# EAGLE design HVIB_v2 (EAGLE 9.1.3)
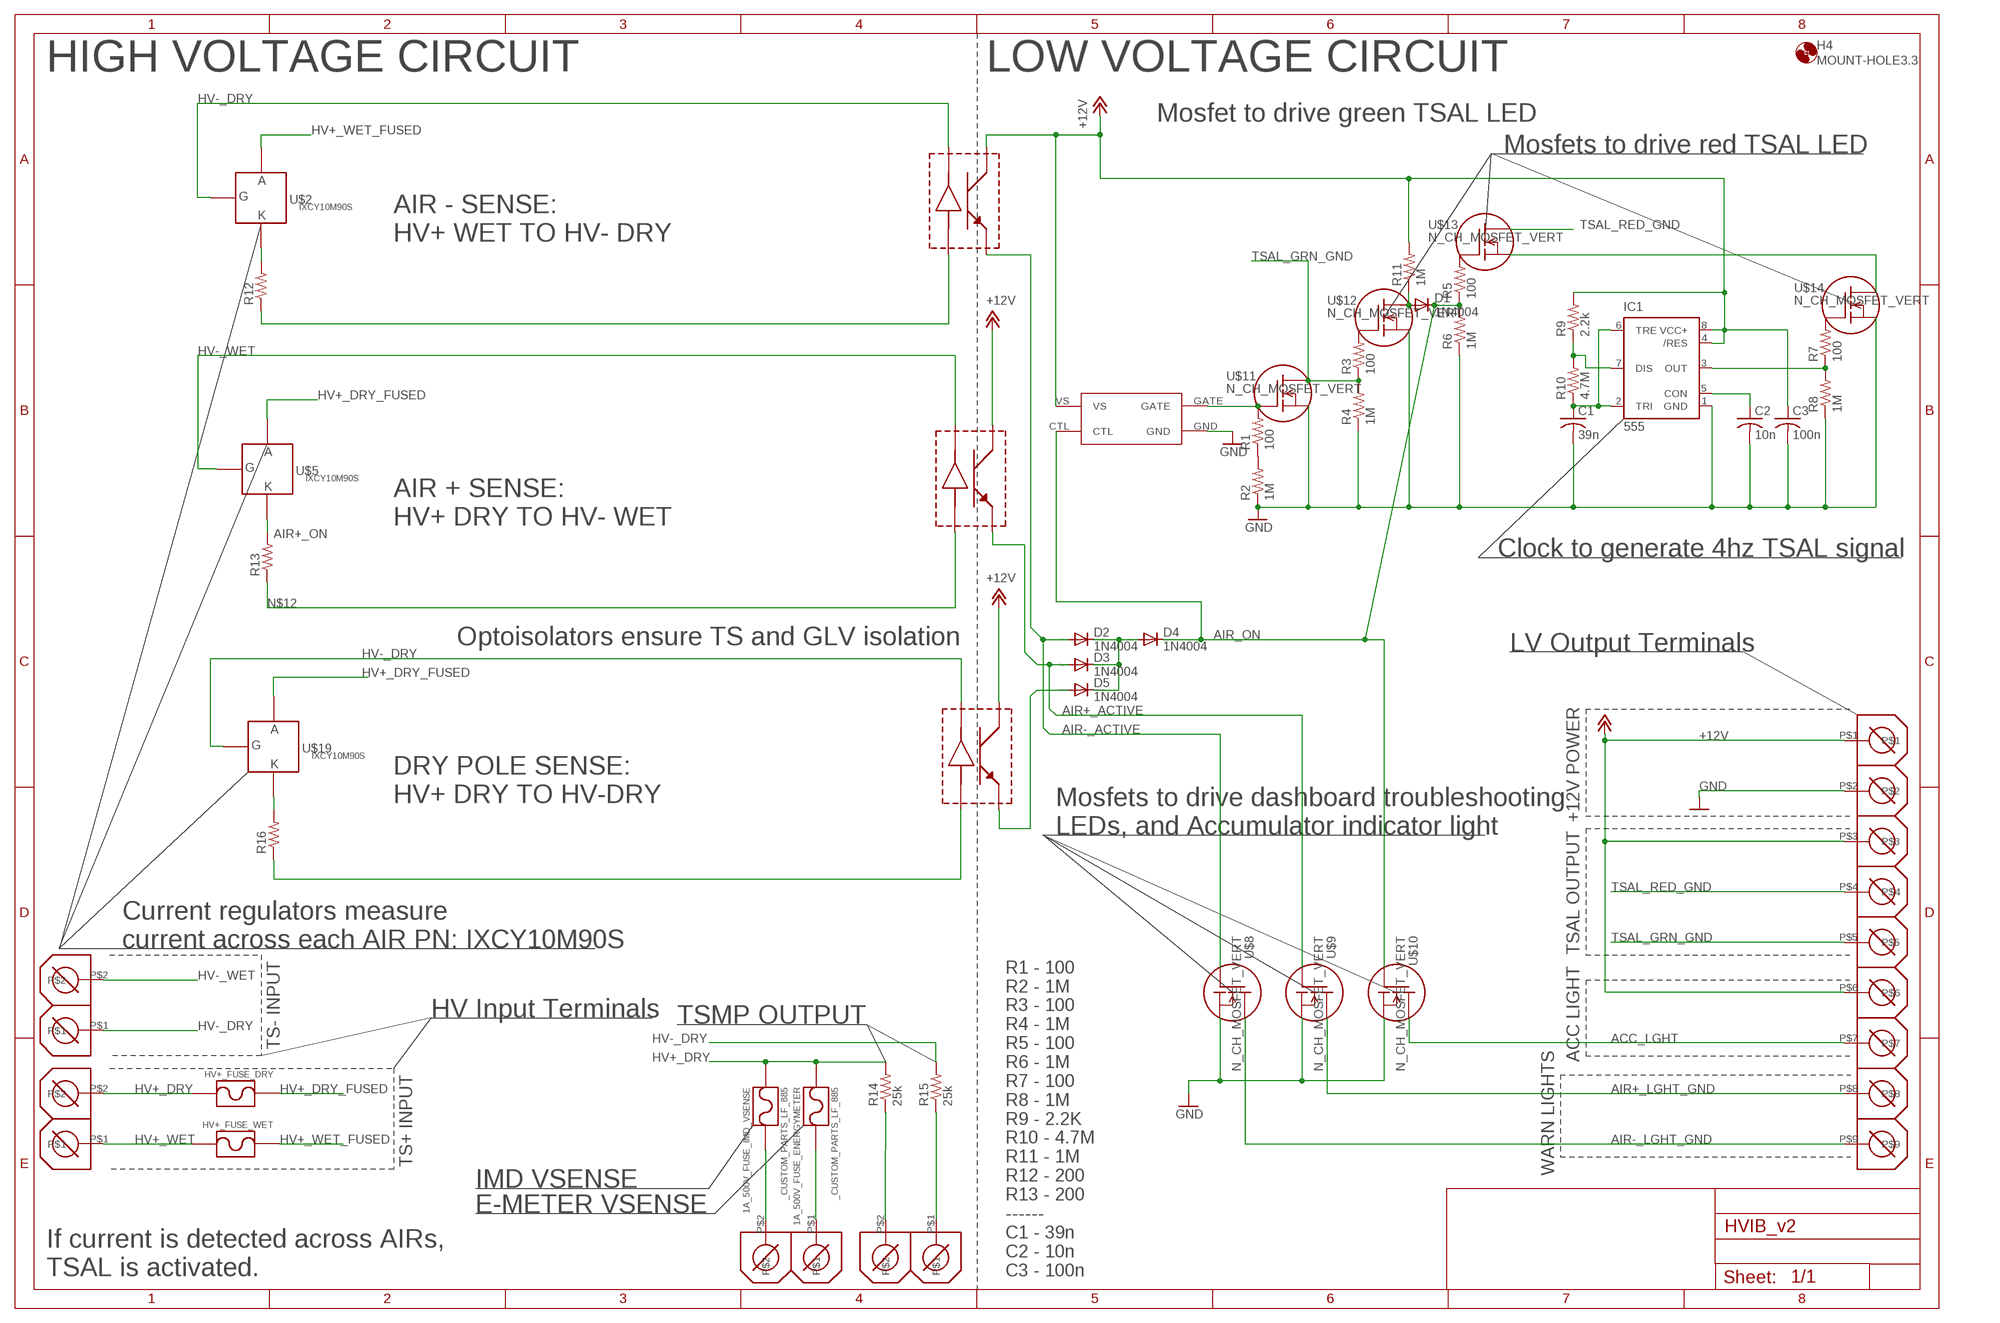
[diagram p0: schematic, sheet 1]

## Parts
1A_500V_FUSE_ENERGYMETER  _CUSTOM_PARTS_LF_885  [_CUSTOM_PARTS_LF_885]
1A_500V_FUSE_IMD_VSENSE  _CUSTOM_PARTS_LF_885  [_CUSTOM_PARTS_LF_885]
C1  39n  C-US025-024X044  [C025-024X044]
C2  10n  C-US025-024X044  [C025-024X044]
C3  100n  C-USC0603  [C0603]
D1  1N4004  [DO41-10]
D2  1N4004  [DO41-10]
D3  1N4004  [DO41-10]
D4  1N4004  [DO41-10]
D5  1N4004  [DO41-10]
H4  MOUNT-HOLE3.3  [3,3]
HV+_FUSE_DRY  _CUSTOM_PARTS_LF_885  [_CUSTOM_PARTS_LF_885]
HV+_FUSE_WET  _CUSTOM_PARTS_LF_885  [_CUSTOM_PARTS_LF_885]
IC1  555  555P  [DIP08]
R1  100  R-US_0204/5  [0204/5]
R2  1M  R-US_0204/5  [0204/5]
R3  100  R-US_0204/5  [0204/5]
R4  1M  R-US_0204/5  [0204/5]
R5  100  R-US_0204/5  [0204/5]
R6  1M  R-US_0204/5  [0204/5]
R7  100  R-US_0204/5  [0204/5]
R8  1M  R-US_0204/5  [0204/5]
R9  2.2k  R-US_0204/5  [0204/5]
R10  4.7M  R-US_0204/5  [0204/5]
R11  1M  R-US_0204/5  [0204/5]
R12  R-US_R2010  [R2010]
R13  R-US_R2010  [R2010]
R14  25k  R-US_R2010  [R2010]
R15  25k  R-US_R2010  [R2010]
R16  R-US_R2010  [R2010]
U$1  OPI7002  [DIL04]
U$2  IXCY10M90S  [D2PACK]
U$3  OPI7002  [DIL04]
U$4  DCDC_PARTS_282838-2_TE  [DCDC_PARTS_282838-2_FOOT]
U$5  IXCY10M90S  [D2PACK]
U$6  DCDC_PARTS_282838-2_TE  [DCDC_PARTS_282838-2_FOOT]
U$7  PHOENIX_1725724  [1725724_FOOT]
U$8  N_CH_MOSFET_VERT  [TO220V]
U$9  N_CH_MOSFET_VERT  [TO220V]
U$10  N_CH_MOSFET_VERT  [TO220V]
U$11  N_CH_MOSFET_VERT  [TO220V]
U$12  N_CH_MOSFET_VERT  [TO220V]
U$13  N_CH_MOSFET_VERT  [TO220V]
U$14  N_CH_MOSFET_VERT  [TO220V]
U$15  MIC4417  [PDM_2019_REVB_MIC4416YM4-TR]
U$16  DCDC_PARTS_282838-2_TE  [DCDC_PARTS_282838-2_FOOT]
U$17  DCDC_PARTS_282838-2_TE  [DCDC_PARTS_282838-2_FOOT]
U$18  OPI7002  [DIL04]
U$19  IXCY10M90S  [D2PACK]

## Nets
+12V: C3.1 IC1.4(/RES) IC1.8(VCC+) R9.2 R11.2 U$1.3(COLLECTOR) U$3.3(COLLECTOR) U$7.P$1 U$7.P$3 U$7.P$6 U$15.VS U$18.3(COLLECTOR)
ACC_LGHT: U$7.P$7 U$10.2(D)
AIR+_ACTIVE: D3.A U$1.4(EMITTER) U$9.1(G)
AIR+_LGHT_GND: U$7.P$8 U$9.2(D)
AIR+_ON [HV]: R13.2 U$5.3(K)
AIR-_ACTIVE: D2.A U$3.4(EMITTER) U$8.1(G)
AIR-_LGHT_GND: U$7.P$9 U$8.2(D)
AIR-_ON [HV]: R12.2 U$2.3(K)
AIR_ON: D1.C D4.C R5.1 R6.2 U$10.1(G) U$15.CTL
GND: C1.2 C2.2 C3.2 IC1.1(GND) R2.1 R4.1 R6.1 R8.1 U$7.P$2 U$8.3(S) U$9.3(S) U$10.3(S) U$11.3(S) U$12.3(S) U$14.3(S) U$15.GND
HV+_DRY [HV]: 1A_500V_FUSE_ENERGYMETER.P$1 1A_500V_FUSE_IMD_VSENSE.P$1 HV+_FUSE_DRY.P$2 R14.2 U$6.P$2
HV+_DRY_FUSED: HV+_FUSE_DRY.P$1 U$5.2(A) U$19.2(A)
HV+_WET [HV]: HV+_FUSE_WET.P$2 U$6.P$1
HV+_WET_FUSED: HV+_FUSE_WET.P$1 U$2.2(A)
HV-_DRY [HV]: R15.2 U$2.1(G) U$3.2(CATHODE) U$4.P$1 U$18.2(CATHODE) U$19.1(G)
HV-_WET [HV]: U$1.2(CATHODE) U$4.P$2 U$5.1(G)
N$1: R1.1 R2.2
N$2: R1.2 U$11.1(G) U$15.GATE
N$3: R3.2 U$12.1(G)
N$4: C2.1 IC1.5(CON)
N$5: IC1.7(DIS) R9.1 R10.2
N$6: R5.2 U$13.1(G)
N$7: R7.2 U$14.1(G)
N$8: IC1.3(OUT) R7.1 R8.2
N$9: C1.1 IC1.2(TRI) IC1.6(TRE) R10.1
N$10 [HV]: R12.1 U$3.1(ANODE)
N$12 [HV]: R13.1 U$1.1(ANODE)
N$13: U$13.3(S) U$14.2(D)
N$14: D2.C D3.C D4.A D5.C
N$15: D1.A R11.1 U$12.2(D)
N$16: R16.2 U$19.3(K)
N$17: R14.1 U$16.P$2
N$18: 1A_500V_FUSE_IMD_VSENSE.P$2 U$17.P$2
N$19 [HV]: 1A_500V_FUSE_ENERGYMETER.P$2 U$17.P$1
N$20: R15.1 U$16.P$1
N$22: R16.1 U$18.1(ANODE)
N$23: D5.A U$18.4(EMITTER)
TSAL_GRN_GND: R3.1 R4.2 U$7.P$5 U$11.2(D)
TSAL_RED_GND: U$7.P$4 U$13.2(D)

## Notes on the sheet
- HIGH VOLTAGE CIRCUIT | LOW VOLTAGE CIRCUIT
- Mosfet to drive green TSAL LED
- Mosfets to drive red TSAL LED
- AIR - SENSE:
  HV+ WET TO HV- DRY
- AIR + SENSE:
  HV+ DRY TO HV- WET
- Clock to generate 4hz TSAL signal
- Optoisolators ensure TS and GLV isolation | LV Output Terminals
- DRY POLE SENSE:
  HV+ DRY TO HV-DRY
- +12V POWER
- Mosfets to drive dashboard troubleshooting
  LEDs, and Accumulator indicator light
- Current regulators measure 
  current across each AIR PN: IXCY10M90S
- TSAL OUTPUT
- TS- INPUT
- HV Input Terminals | TSMP OUTPUT
- ACC LIGHT
- TS+ INPUT
- WARN LIGHTS
- IMD VSENSE
- E-METER VSENSE
- If current is detected across AIRs, 
  TSAL is activated.
- R1 - 100
  R2 - 1M
  R3 - 100
  R4 - 1M
  R5 - 100
  R6 - 1M
  R7 - 100
  R8 - 1M
  R9 - 2.2K
  R10 - 4.7M
  R11 - 1M
  R12 - 200
  R13 - 200
  ------
  C1 - 39n
  C2 - 10n
  C3 - 100n

## Library data of the parts
1A_500V_FUSE_ENERGYMETER 1A_500V_FUSE_IMD_VSENSE HV+_FUSE_DRY HV+_FUSE_WET = _CUSTOM:_CUSTOM_PARTS_LF_885
C1-C3 = rcl:C-US: CAPACITOR, American symbol; SPICEPREFIX: C
D1-D5 = diode:1N4004: DIODE general purpose rectifier, 1 A
H4 = holes:MOUNT-HOLE: MOUNTING HOLE with drill center marker
IC1 = SparkFun-IC-Special-Function:555: General purpose bipolar Timer Datasheet <http://www.sparkfun.com/datasheets/Components/General/ne555.pdf> SparkFun Products SparkFun SparkPunk Sequencer Kit <https://www.sparkfun.com/products/12707> (KIT-12707) Storefront Component: 555 Timer <https://www.sparkfun.com/products/9273> (COM-09273) Two parts valid for production: VFP: IC-11930 (M7555 PTH) VFP: IC-09173 (555 PTH) - Preferred; PROD_ID: IC-09173; PROD_ID_ALT: IC-09173
R1-R16 = rcl:R-US_: RESISTOR, American symbol; SPICEPREFIX: R
U$1 U$3 U$18 = _CUSTOM:OPI7002
U$2 U$5 U$19 = _CUSTOM:IXCY10M90S
U$4 U$6 U$16 U$17 = _CUSTOM:DCDC_PARTS_282838-2_TE
U$7 = 111_Custom:PHOENIX_1725724
U$8-U$14 = 111_Custom:N_CH_MOSFET_VERT
U$15 = HVIB_v2:MIC4417; MPN: MIC4417

## Net classes
0 LV: width 0.2 mm, drill 0.15 mm, clearance 0.152 mm
1 HV: width 0.5 mm, drill 0.15 mm, clearance 0.152 mm

## Board
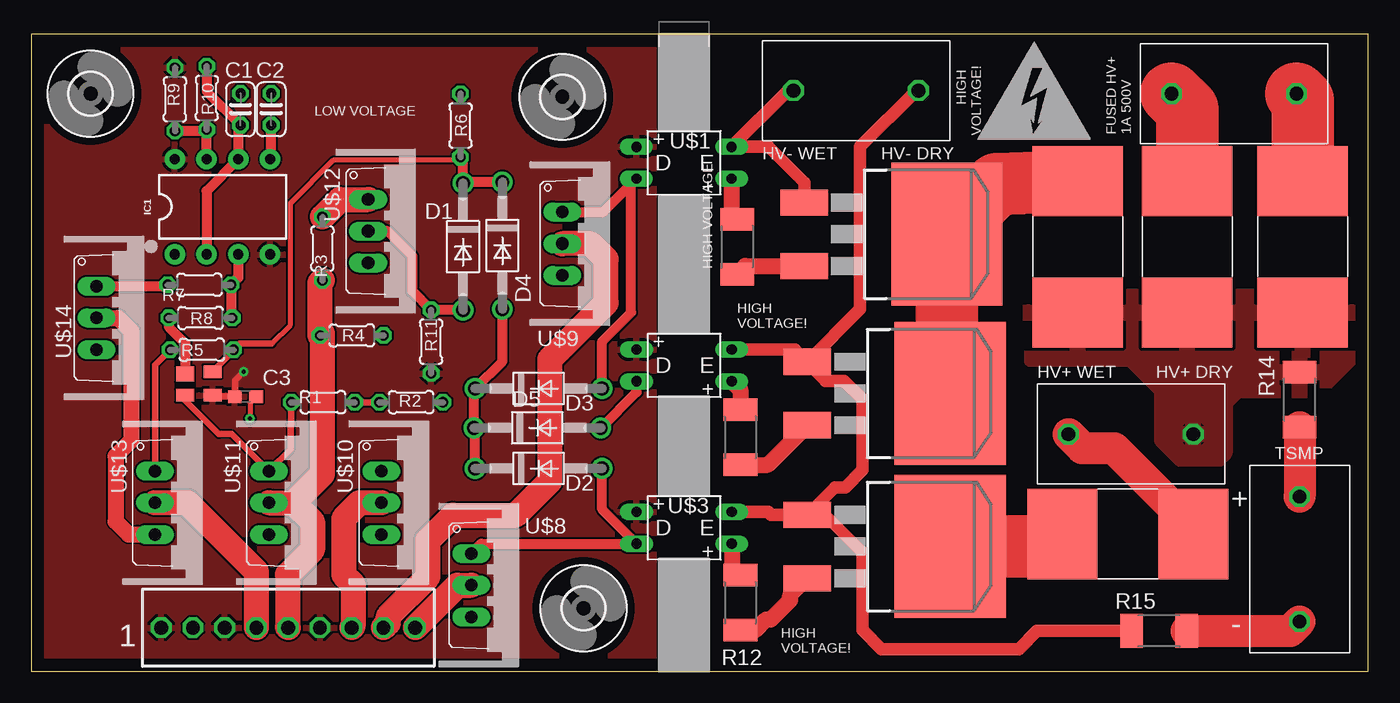
[diagram p1: board, top side]
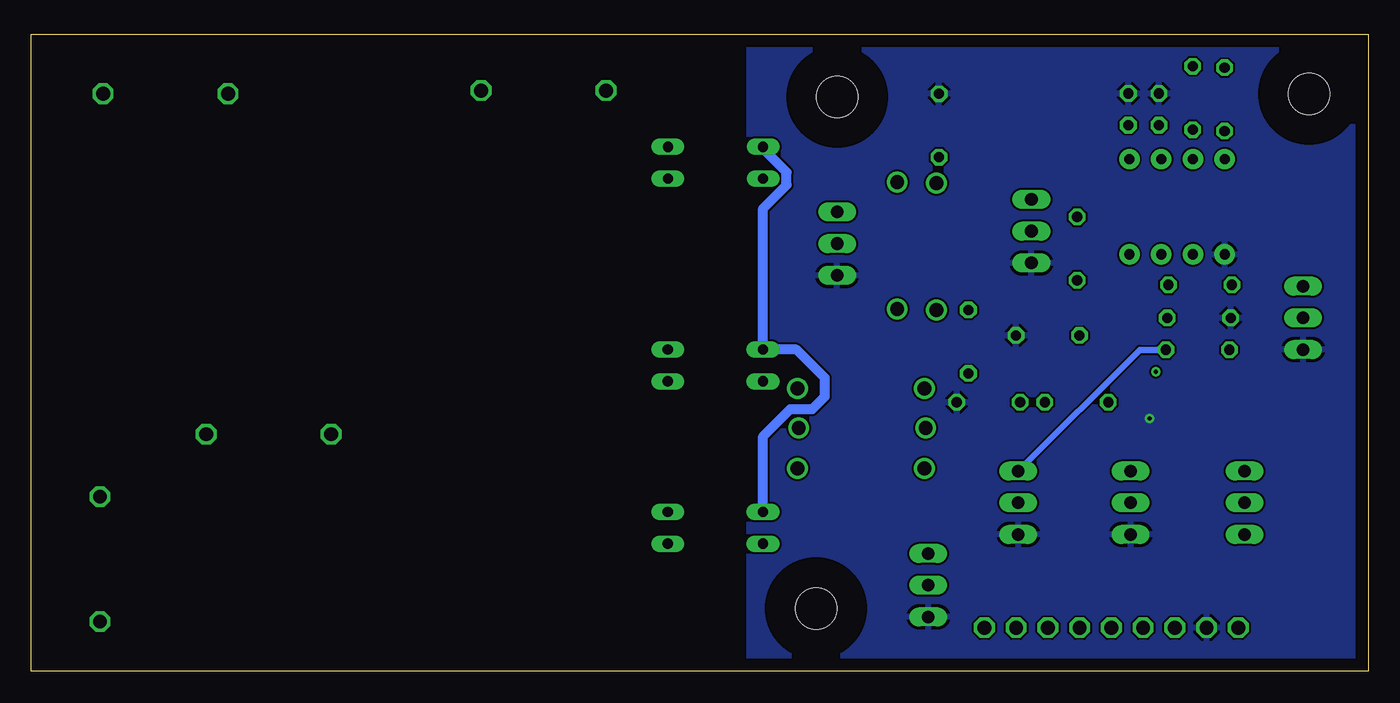
[diagram p2: board, bottom side, seen from below]

Size 107 x 51 mm. Coordinates in mm from the lower left corner, seen from the top.
Outline: 0,0 107,0 107,51 0,51 0,0
Copper layers (1*16): Top 0.035mm / dielectric 1.5mm / Bottom 0.035mm
Design rules "default": minimum track width 6mil, minimum drill 0.35mm, track to track 6mil, track to pad 6mil, pad to pad 6mil, via to via 6mil, smd to smd 6mil, copper to edge 40mil, drill to drill 6mil, minimum pad ring 10mil, minimum via ring 8mil, stop-mask expansion 4mil, vias tented up to drill 0mil, thermal gap 10mil
tRestrict: area 50.2,0 to 54.2,51
bRestrict: area 50.2,0 to 54.2,51

### Footprints (pad centres in the part's own frame; a part is rotated, then mirrored left to right if it is on the bottom)
_CUSTOM_PARTS_LF_885 = smd 5.6 x 7.23: P$1 5.25,0; P$2 -5.25,0
C025-024X044 = drill 0.813 octagon: 1 -1.27,0; 2 1.27,0
C0603 = smd 1.1 x 1: 1 -0.85,0; 2 0.85,0
DO41-10 = drill 1.118: A 5.08,0; C -5.08,0
3,3 = hole 3.3: 0,0
DIP08 = drill 0.813 pad 1.626: 1 -3.81,-3.81; 2 -1.27,-3.81; 3 1.27,-3.81; 4 3.81,-3.81; 5 3.81,3.81; 6 1.27,3.81; 7 -1.27,3.81; 8 -3.81,3.81
0204/5 = drill 0.813 octagon: 1 -2.54,0; 2 2.54,0
R2010 = smd 1.8 x 2.7: 1 -2.2,0; 2 2.2,0
DIL04 = drill 0.813 long: 1 -1.27,-3.81; 2 1.27,-3.81; 3 1.27,3.81; 4 -1.27,3.81
D2PACK = smd 2.083 x 3.81: 1 -2.54,-8.89; 3 2.54,-8.89 | smd 11.43 x 8.89: 2 0,2.54
DCDC_PARTS_282838-2_FOOT = drill 1.1 octagon: P$1 0,0; P$2 10,0
1725724_FOOT = drill 1.1 octagon: P$1 0,0; P$2 2.54,0; P$3 5.08,0; P$4 7.62,0; P$5 10.16,0; P$6 12.7,0; P$7 15.24,0; P$8 17.78,0; P$9 20.32,0
TO220V = drill 1.016 long: 1 -2.54,-2.54; 2 0,-2.54; 3 2.54,-2.54
PDM_2019_REVB_MIC4416YM4-TR = smd 1 x 1.44: CTL 0,0; GATE 1.9,-2.2; VS 1.9,0 | smd 1.2 x 1.44: GND 0.2,-2.2

### Placement (x,y rotation side)
1A_500V_FUSE_ENERGYMETER  101.75,34 270 top
1A_500V_FUSE_IMD_VSENSE  92.5,34 270 top
C1  16.75,45 90 top
C2  19.2,45 90 top
C3  17.15,22 0 top
D1  34.55,34 270 top
D2  40.6,16.25 0 top
D3  40.6,22.65 0 top
D4  37.7,34.1 270 top
D5  40.5,19.5 0 top
H1  MOUNT-HOLE3.3  [3,3]  4.75,46.25 0 top
H2  MOUNT-HOLE3.3  [3,3]  42.5,46 0 top
H4  44.2,5.05 0 top
HV+_FUSE_DRY  83.75,34 90 top
HV+_FUSE_WET  87.75,11 180 top
IC1  15.3,37.2 0 top
R1  23.35,21.55 180 top
R2  30.4,21.55 180 top
R3  23.3,33.85 90 top
R4  25.65,26.9 180 top
R5  13.65,25.75 180 top
R6  34.35,43.7 270 top
R7  13.45,30.95 180 top
R8  13.55,28.3 0 top
R9  11.5,45.8 90 top
R10  14.05,45.9 270 top
R11  32,26.4 270 top
R12  56.75,5.5 270 top
R13  56.5,34 270 top
R14  101.5,21.75 90 top
R15  90.25,3.25 180 top
R16  56.75,18.75 270 top
U$1  52.24,40.72 90 top
U$2  71,10 270 top
U$3  52.25,11.5 90 top
U$4  71,46.5 180 top
U$5  70.75,35 270 top
U$6  83,19 0 top
U$7  10.4,3.5 0 top
U$8  37.75,6.9 270 top
U$9  45.05,34.25 270 top
U$10  30.55,13.5 270 top
U$11  21.55,13.5 270 top
U$12  29.5,35.25 270 top
U$13  12.45,13.5 270 top
U$14  7.75,28.3 270 top
U$15  14.5,24 270 top
U$16  101.5,4 90 top
U$17  101.25,46.25 180 top
U$18  52.25,24.5 90 top
U$19  71,22.25 270 top

### Tracks (layer width: path | path; a pad name or v marks a point on that pad's centre or on a via)
+12V  (via drill 0.35)
  Top 0.508: U$15.VS 14.6,22 C3.1 16.3,23.3 v17,24
  Bottom 0.813: U$3.3 48.44,18.81 46.25,21 44.5,21 43.5,22 43.5,23.5 45.77,25.77 U$18.3 48.44,37.05 46.55,38.95 46.55,39.95 48.44,41.84 U$1.3
  pour Top: -1.9,53.1 49.8,53.1 49.8,-2 -1.9,-2
ACC_LGHT
  Top 2: U$10.2 26.25,13.5 25,12.25 25,7.75 25.75,7 25.75,3.61 U$7.P$7
AIR+_ACTIVE
  Top 0.813: D3.A 45.68,26.43 48,28.75 48,39.02 U$1.4 45.77,36.79 U$9.1
AIR+_LGHT_GND
  Top 2: U$7.P$8 28.57,3.89 28.57,4.39 31.75,7.57 31.75,10.5 33.75,12.5 38.75,12.5 41.5,15.25 41.5,25 46,29.5 46,33 44.75,34.25 U$9.2
AIR+_ON
  Top 1.27: U$5.3 57.16,32.46 R13.2
AIR-_ACTIVE
  Top 0.813: U$8.1 36,10.23 U$3.4 45.68,12.99 D2.A
AIR-_LGHT_GND
  Top 2: U$7.P$9 34.12,6.9 U$8.2
AIR-_ON
  Top 1.27: R12.2 57.95,3.3 58.81,4.17 59.19,4.17 60.73,5.71 60.73,6.08 U$2.3
AIR_ON
  Top 0.406: 19.25,26.25 20.75,27.75 20.75,37.5 24.21,40.96 34.55,40.96
  Top 0.508: 19.25,26.25 16.69,26.25 R5.1 16.19,25.69 U$15.CTL
  Top 0.813: D4.C 34.65,39.18 D1.C 34.55,40.96 R6.2
  Bottom 0.508: U$10.1 18.3,25.75 R5.1
GND  (via drill 0.35)
  Top 0.406: C3.2 17.5,21.5 v17.5,20.25
  Top 0.813: R8.1 11.01,27.57 12.33,26.25 12.33,25.25 12.3,25.22 U$15.GND
  pour Bottom: -1,51.9 49.55,51.9 49.55,-2 -1,-2
HV+_DRY
  pour Top: 80,30 105.5,30 105.5,26 105.5,25 103,22.5 100,22.5 96.5,22.5 95.5,21.5 95.5,17.5 95,17 93,17 92,17 91,18 90.5,18.5 90.5,21.5 90.5,22.5 88,25 80,25
HV+_DRY_FUSED
  Top 5: HV+_FUSE_DRY.P$1 77.29,39 U$5.2 73.29,22.5 U$19.2
HV+_WET
  Top 2.54: U$6.P$1 84.11,17.89 86.65,17.89 92.25,12.29 92.25,10.75 92.5,11 HV+_FUSE_WET.P$2
HV+_WET_FUSED
  Top 5: U$2.2 81.5,10 HV+_FUSE_WET.P$1
HV-_DRY
  Top 1.016: U$3.2 58.98,12.77 59.21,12.54 U$2.1 | U$18.2 61.13,25.77 U$19.1 | U$19.1 62.11,24.7 63.55,23.26 65.05,23.26 66.52,21.79 66.52,16.13 65.14,14.75 64.32,14.75 U$2.1 | R15.2 80.5,3.25 79.02,1.78 68.06,1.78 66.52,3.31 66.52,9.54 63.52,12.54 U$2.1 | U$19.1 66.34,29.02 66.34,42 70.83,46.5 U$4.P$1
HV-_WET
  Top 1.016: U$4.P$2 60.56,46.5 U$1.2 59.01,41.99 61.86,39.14 U$5.1
N$1
  Top 0.508: R1.1 R2.2
N$2
  Top 0.508: R1.2 20.81,19.81 20.75,19.75 20.75,17.78 U$11.1 16.05,19 15,19 12.3,21.7 U$15.GATE
N$3
  Top 2: R3.2 24.7,37.79 U$12.1
N$4
  Top 0.813: IC1.5 19.2,41.1 C2.1
N$5
  Top 0.813: IC1.7 14.03,43.34 R10.2 13.95,43.26 R9.1
N$6
  Top 0.508: U$13.1 9.91,24.55 R5.2
N$7
  Top 0.813: U$14.1 10.8,30.84 R7.2
N$8
  Top 0.813: IC1.3 16.57,31.53 R7.1 15.99,28.4 R8.2
N$9
  Top 0.813: R10.1 14.05,46.43 C1.1 16.57,43.55 IC1.6 14.03,38.47 IC1.2
N$10
  Top 1.27: U$3.1 56.06,8.39 R12.1
N$12
  Top 1.27: U$1.1 56.05,36.65 R13.1
N$13
  Top 1.27: U$14.2 6.95,28.3 8,27.25 8,18.5 6.75,17.25 6.75,12 7.79,10.96 U$13.3
N$14
  Top 0.813: D2.C 35.52,19.4 D5.C 35.42,22.55 D3.C 37.7,24.83 D4.A
N$15
  Top 0.813: D1.A 32.02,28.92 R11.1 30.5,30.44 30.5,33.25 28.5,35.25 U$12.2
N$16
  Top 1.27: R16.2 58.95,16.55 U$19.3
N$17
  Top 2.54: R14.1 U$16.P$2
N$18
  Top 5: U$17.P$2 92.5,45 1A_500V_FUSE_IMD_VSENSE.P$2
N$19
  Top 5: U$17.P$1 101.75,45.75 1A_500V_FUSE_ENERGYMETER.P$2
N$20
  Top 2.54: R15.1 100.75,3.25 U$16.P$1
N$22
  Top 1.27: U$18.1 56.75,22.54 R16.1
N$23
  Top 0.813: D5.A 48.44,22.36 U$18.4
TSAL_GRN_GND
  Top 0.813: 23.3,27.09 R4.2
  Top 2: 21,13.5 22.5,12 22.5,9.75 20.5,7.75 20.5,3.56 U$7.P$5 | U$11.2 21,13.5 | 21,13.5 23.3,15.8 23.3,27.09 | R4.2 23.11,31.12 R3.1
TSAL_RED_GND
  Top 2: U$7.P$4 18.02,7.98 12.5,13.5 U$13.2

### Text on the board
tPlace: HIGH / VOLTAGE! | LOW VOLTAGE | FUSED HV+ / 1A 500V | HV- WET | HV- DRY | HIGH VOLTAGE | HIGH / VOLTAGE! | HV+ WET | HV+ DRY | TSMP | + | - | 1 | HIGH / VOLTAGE!
Measures: HV- INPUTS | Fasteners on LV side only | HV+ OUTPUTS FUSED | HV+ INPUTS | TSMP RESISTORS | 4MM GLV and TS ISOLATION LINE | LV TERMINAL